# EAGLE design samd21_sensorhub_1.2.5_dec2023 (EAGLE 9.6.2)
VERSION: V1.1 Jan 2022

## Sheet 1 of 2
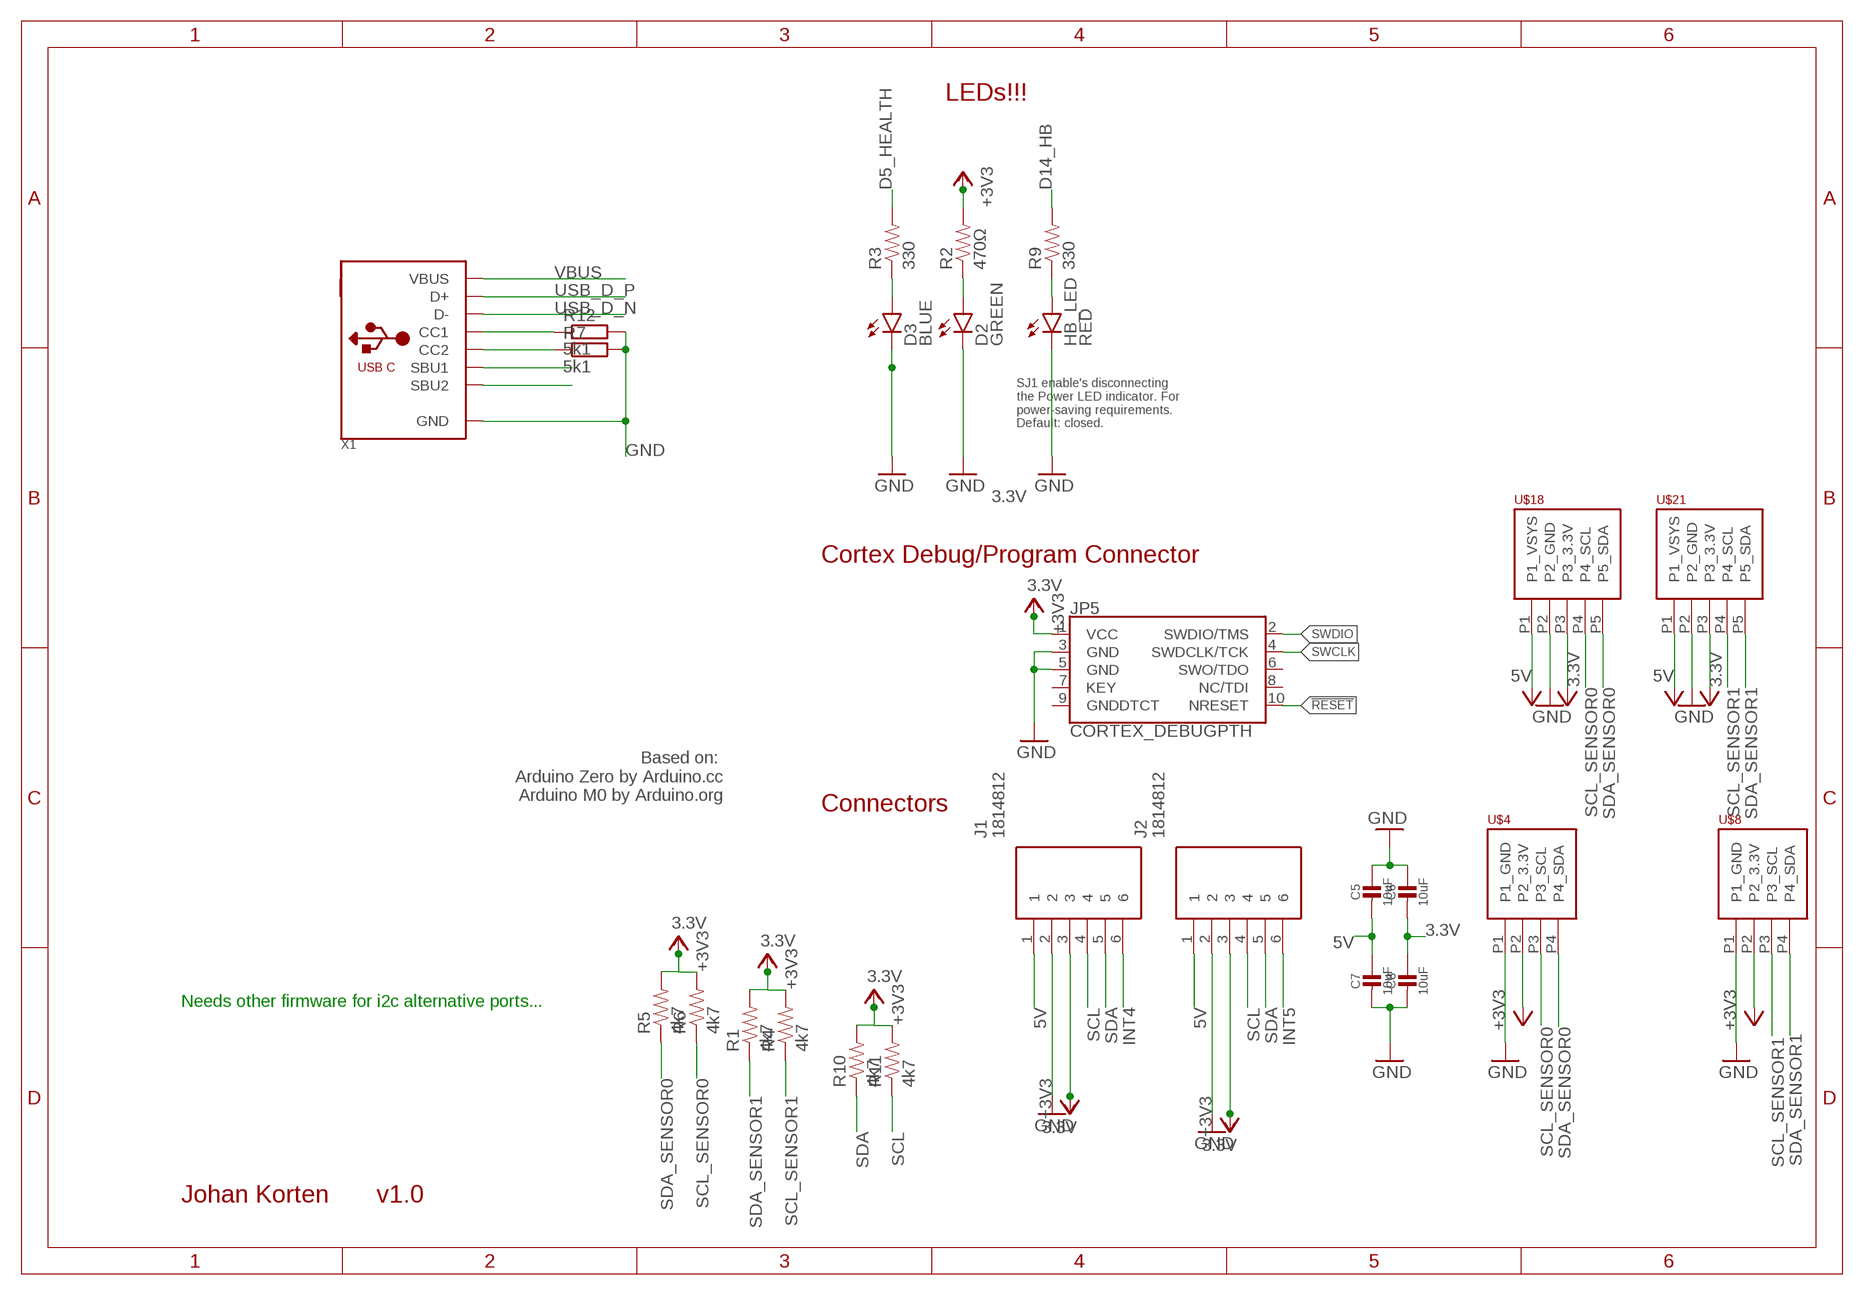
[diagram p0: schematic, sheet 1]

### Parts
C5  10uF  CAP_CERAMIC0805-NOOUTLINE  [0805-NO]
C6  10uF  CAP_CERAMIC0805-NOOUTLINE  [0805-NO]
C7  10uF  CAP_CERAMIC0805-NOOUTLINE  [0805-NO]
C8  10uF  CAP_CERAMIC0805-NOOUTLINE  [0805-NO]
D2  GREEN  LED-RED0603  [LED-0603]
D3  BLUE  LED-BLUE0603  [LED-0603]
HB_LED  RED  LED-RED0603  [LED-0603]
J1  1814812  [1814812]
J2  1814812  [1814812]
JP5  CORTEX_DEBUGPTH  [2X5-PTH-1.27MM]
R1  4k7  330OHM1/10W1%(0603)  [0603-RES]
R2  470Ω  330OHM1/10W1%(0603)  [0603-RES]
R3  330  330OHM1/10W1%(0603)  [0603-RES]
R4  4k7  330OHM1/10W1%(0603)  [0603-RES]
R5  4k7  330OHM1/10W1%(0603)  [0603-RES]
R6  4k7  330OHM1/10W1%(0603)  [0603-RES]
R7  5k1  R-EU_R0603  [R0603]
R9  330  330OHM1/10W1%(0603)  [0603-RES]
R10  4k7  330OHM1/10W1%(0603)  [0603-RES]
R11  4k7  330OHM1/10W1%(0603)  [0603-RES]
R12  5k1  R-EU_R0603  [R0603]
U$4  PHOENIX_PTSM_M4_THANGLE  [PTSM_M4_TH]
U$8  PHOENIX_PTSM_M4_THANGLE  [PTSM_M4_TH]
U$18  PHOENIX_PTSM_M5_TH_I2C++  [PTSM_M5_THRHOLE]
U$21  PHOENIX_PTSM_M5_TH_I2C++  [PTSM_M5_THRHOLE]
X1  USB_C  [USB_C_CUSB31-CFM2AX-01-X]

### Nets
3.3V [power]: C6.2 C8.1 J1.3 J2.3 JP5.1(VCC) R1.2 R2.2 R4.2 R5.2 R6.2 R10.2 R11.2 U$4.P2(P2_3.3V) U$8.P2(P2_3.3V) U$18.P3(P3_3.3V) U$21.P3(P3_3.3V) ; supply symbol labelled +3V3 ; also sheet 2
5V [power]: C5.2 C7.1 J1.1 J2.1 U$18.P1(P1_VSYS) U$21.P1(P1_VSYS) ; supply symbol labelled +5V ; also sheet 2
!RESET: JP5.10(NRESET) ; also sheet 2
D5_HEALTH: R3.2 ; also sheet 2
D5_HEALTH_LED: D3.A R3.1
D14_HB: R9.2 ; also sheet 2
D14_HB_LED: HB_LED.A R9.1
GND [ground]: C5.1 C6.1 C7.2 C8.2 D2.C D3.C HB_LED.C J1.2 J2.2 JP5.3(GND) JP5.5(GND) R7.2 R12.2 U$4.P1(P1_GND) U$8.P1(P1_GND) U$18.P2(P2_GND) U$21.P2(P2_GND) X1.A1B12(GND) X1.B1A12(GND) ; also sheet 2
INT4: J1.6 ; also sheet 2
INT5: J2.6 ; also sheet 2
N$1: R12.1 X1.A5(CC1)
N$2: R7.1 X1.B5(CC2)
N$5: D2.A R2.1
N$7: X1.A8(SBU1)
N$9: X1.B8(SBU2)
SCL: J1.4 J2.4 R11.1 ; also sheet 2
SCL_SENSOR0: R6.1 U$4.P3(P3_SCL) U$18.P4(P4_SCL) ; also sheet 2
SCL_SENSOR1: R4.1 U$8.P3(P3_SCL) U$21.P4(P4_SCL) ; also sheet 2
SDA: J1.5 J2.5 R10.1 ; also sheet 2
SDA_SENSOR0: R5.1 U$4.P4(P4_SDA) U$18.P5(P5_SDA) ; also sheet 2
SDA_SENSOR1: R1.1 U$8.P4(P4_SDA) U$21.P5(P5_SDA) ; also sheet 2
SWCLK: JP5.4(SWDCLK/TCK) ; also sheet 2
SWDIO: JP5.2(SWDIO/TMS) ; also sheet 2
USB_D_N [usb]: X1.A7(D-) X1.B7(D-) ; also sheet 2
USB_D_P [usb]: X1.A6(D+) X1.B6(D+) ; also sheet 2
VBUS [power]: X1.A4B9(VBUS) X1.B4A9(VBUS) ; also sheet 2
Unconnected: JP5.6(SWO/TDO) JP5.7(KEY) JP5.8(NC/TDI) JP5.9(GNDDTCT)

### Notes on the sheet
- LEDs!!!
- SJ1 enable's disconnecting
  the Power LED indicator. For
  power-saving requirements.
  Default: closed.
- Cortex Debug/Program Connector
- Based on: 
  Arduino Zero by Arduino.cc
  Arduino M0 by Arduino.org
- Connectors
- Needs other firmware for i2c alternative ports...
- Johan Korten | v1.0

## Sheet 2 of 2: Controller SAMD21 based on Adafruit Feather M0 Express
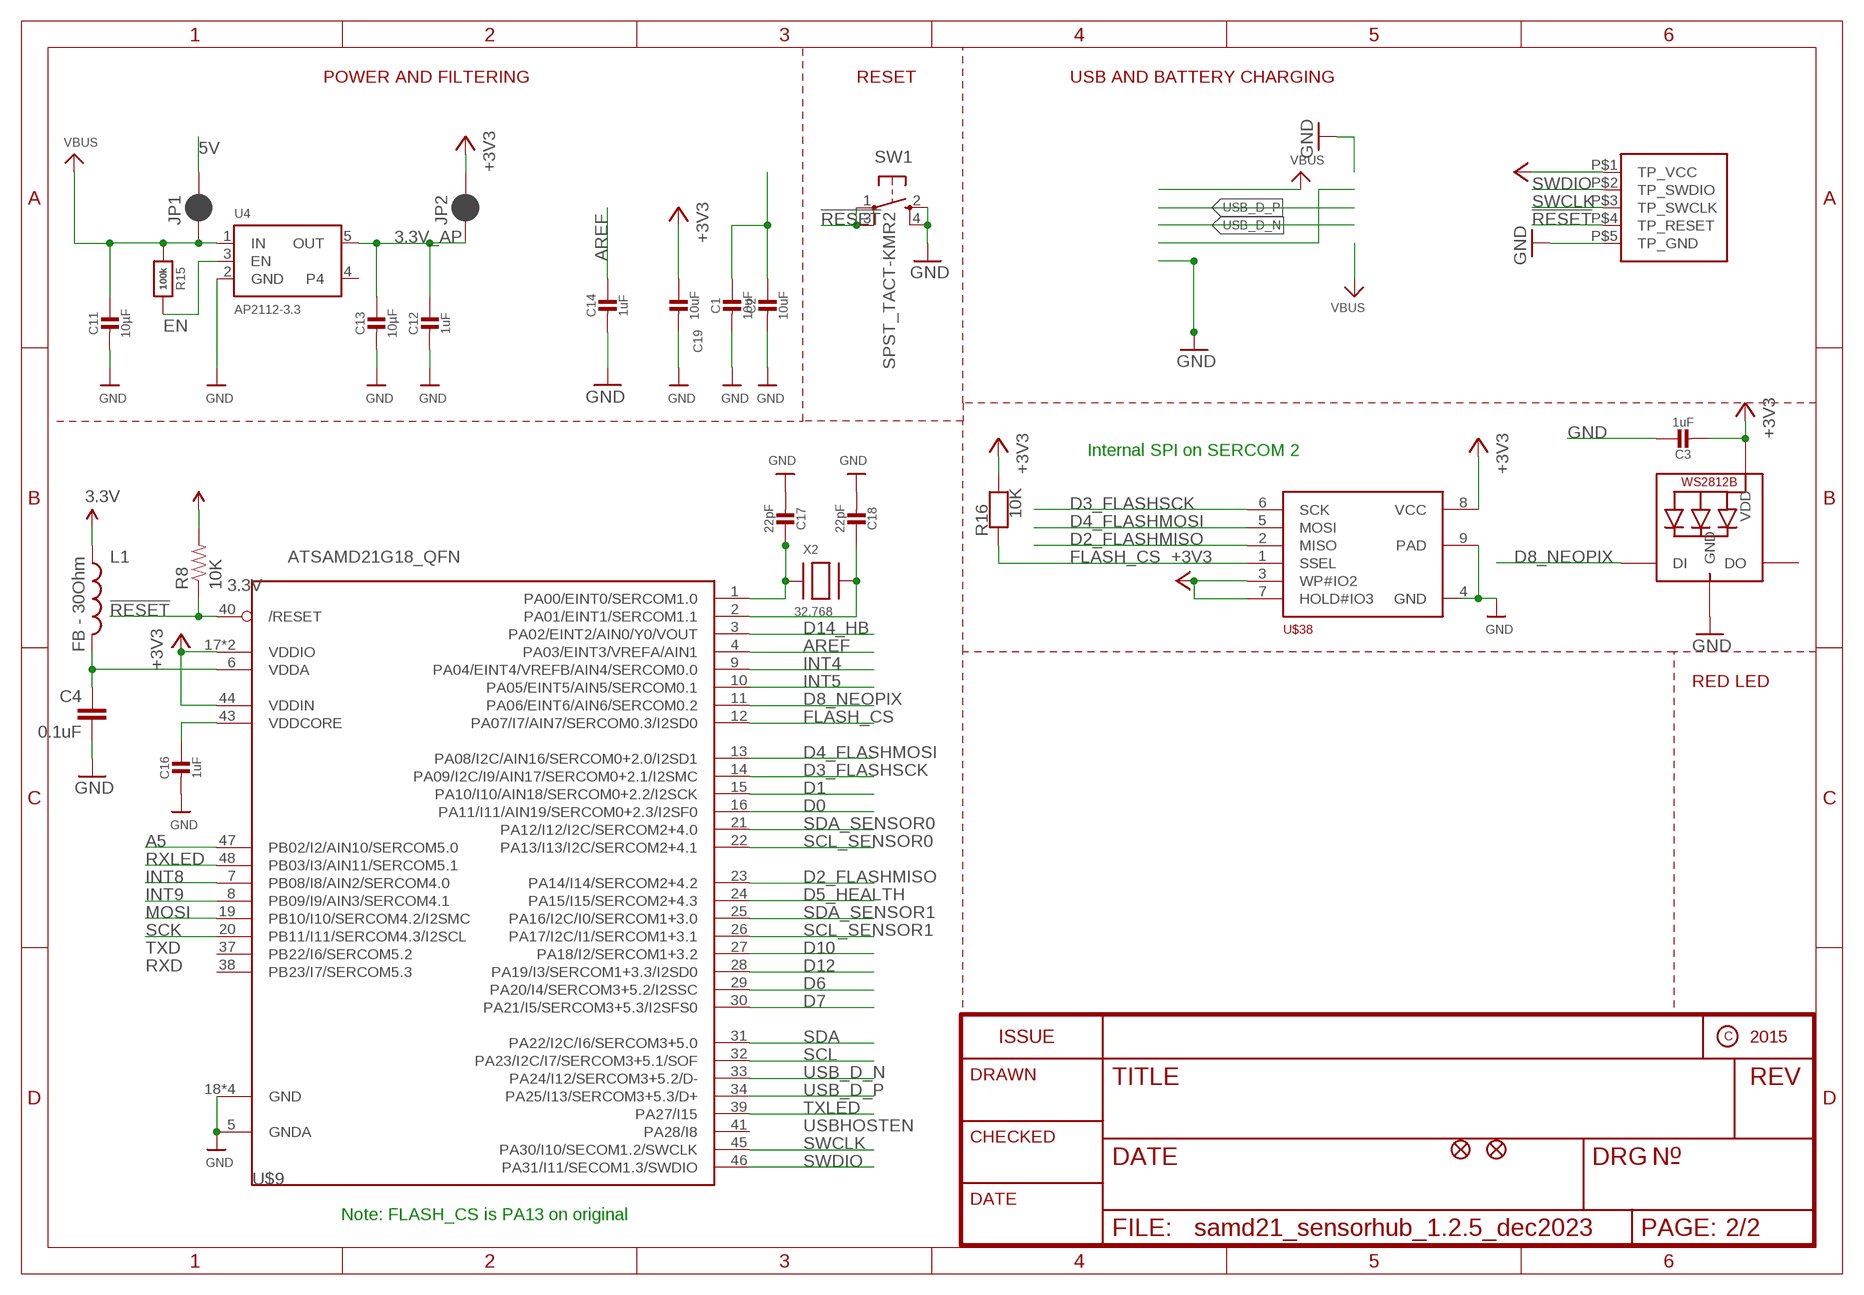
[diagram p1: schematic, sheet 2]

### Parts
C1  10uF  CAP_CERAMIC0805-NOOUTLINE  [0805-NO]
C2  10uF  CAP_CERAMIC0805-NOOUTLINE  [0805-NO]
C3  1uF  CAP_CERAMIC0603_NO  [0603-NO]
C4  0.1uF  0.1UF-16V(+-10%)(0402)  [0402-CAP]
C11  10µF  CAP_CERAMIC0805-NOOUTLINE  [0805-NO]
C12  1uF  CAP_CERAMIC0603_NO  [0603-NO]
C13  10µF  CAP_CERAMIC0805-NOOUTLINE  [0805-NO]
C14  1uF  CAP_CERAMIC0603_NO  [0603-NO]
C16  1uF  CAP_CERAMIC0603_NO  [0603-NO]
C17  22pF  CAP_CERAMIC0603_NO  [0603-NO]
C18  22pF  CAP_CERAMIC0603_NO  [0603-NO]
C19  10uF  CAP_CERAMIC0805-NOOUTLINE  [0805-NO]
JP1  JUMPER-SMT_2_NC_PASTE_SILK  [SMT-JUMPER_2_NC_PASTE_SILK]
JP2  JUMPER-SMT_2_NC_PASTE_SILK  [SMT-JUMPER_2_NC_PASTE_SILK]
L1  FB - 30Ohm  INDUCTOR0603  [0603]
LED1  WS2812B3535  [LED3535]
R8  10K  10KOHM-1/10W-1%(0603)0603  [0603-RES]
R15  100k  RESISTOR_0603_NOOUT  [0603-NO]
R16  10K  RESISTOR_0603_NOOUT  [0603-NO]
SW1  SPST_TACT-KMR2  [KMR2]
U4  AP2112-3.3  VREG_SOT23-5  [SOT23-5]
U$5  HUB_TESTPINSHUBS  [TEST_PINS]
U$9  ATSAMD21G18_QFN  ATSAMD21G_QFN  [TQFN48_7MM]
U$34  FIDUCIAL""  [FIDUCIAL_1MM]
U$35  FIDUCIAL""  [FIDUCIAL_1MM]
U$38  S25FL064LABNFI040  [SON80P400X400X60-9N]
X2  32.768  XTAL-3.2X1.5  [XTAL3215]

### Nets
3.3V [power]: C3.2 C19.1 JP2.2 L1.1 LED1.2(VDD) R8.2 R16.2 U$5.P$1(TP_VCC) U$9.17(VDDIO) U$9.36(VDDIO) U$9.44(VDDIN) U$38.3(WP#IO2) U$38.7(HOLD#IO3) U$38.8(VCC) ; supply symbol labelled +3V3 ; also sheet 1
3.3V_AP [power]: C12.1 C13.1 JP2.1 U4.5(OUT)
5V [power]: C1.1 C2.1 JP1.2 ; also sheet 1
!RESET: R8.1 SW1.1(P) SW1.3(P1) U$5.P$4(TP_RESET) U$9.40(/RESET) ; also sheet 1
A5: U$9.47(PB02/I2/AIN10/SERCOM5.0)
AREF [power]: C14.1 U$9.4(PA03/EINT3/VREFA/AIN1)
D0: U$9.16(PA11/I11/AIN19/SERCOM0+2.3/I2SF0)
D1: U$9.15(PA10/I10/AIN18/SERCOM0+2.2/I2SCK)
D2_FLASHMISO: U$9.23(PA14/I14/SERCOM2+4.2) U$38.2(MISO)
D3_FLASHSCK: U$9.14(PA09/I2C/I9/AIN17/SERCOM0+2.1/I2SMC) U$38.6(SCK)
D4_FLASHMOSI: U$9.13(PA08/I2C/AIN16/SERCOM0+2.0/I2SD1) U$38.5(MOSI)
D5_HEALTH: U$9.24(PA15/I15/SERCOM2+4.3) ; also sheet 1
D6: U$9.29(PA20/I4/SERCOM3+5.2/I2SSC)
D7: U$9.30(PA21/I5/SERCOM3+5.3/I2SFS0)
D8_NEOPIX: LED1.1(DI) U$9.11(PA06/EINT6/AIN6/SERCOM0.2)
D10: U$9.27(PA18/I2/SERCOM1+3.2)
D12: U$9.28(PA19/I3/SERCOM1+3.3/I2SD0)
D14_HB: U$9.3(PA02/EINT2/AIN0/Y0/VOUT) ; also sheet 1
EN: R15.2 U4.3(EN)
FLASH_CS: R16.1 U$9.12(PA07/I7/AIN7/SERCOM0.3/I2SD0) U$38.1(SSEL)
GND [ground]: C1.2 C2.2 C3.1 C4.2 C11.2 C12.2 C13.2 C14.2 C16.2 C17.2 C18.2 C19.2 LED1.4(GND) SW1.2(S) SW1.4(S1) U4.2(GND) U$5.P$5(TP_GND) U$9.5(GNDA) U$9.18(GND) U$9.35(GND) U$9.42(GND) U$9.THERMAL(GND) U$38.4(GND) U$38.9(PAD) ; also sheet 1
INT4: U$9.9(PA04/EINT4/VREFB/AIN4/SERCOM0.0) ; also sheet 1
INT5: U$9.10(PA05/EINT5/AIN5/SERCOM0.1) ; also sheet 1
INT8: U$9.7(PB08/I8/AIN2/SERCOM4.0)
INT9: U$9.8(PB09/I9/AIN3/SERCOM4.1)
MOSI: U$9.19(PB10/I10/SERCOM4.2/I2SMC)
N$15: C17.1 U$9.1(PA00/EINT0/SERCOM1.0) X2.P$1
N$17: C18.1 U$9.2(PA01/EINT1/SERCOM1.1) X2.P$2
RXLED: U$9.48(PB03/I3/AIN11/SERCOM5.1)
SCK: U$9.20(PB11/I11/SERCOM4.3/I2SCL)
SCL: U$9.32(PA23/I2C/I7/SERCOM3+5.1/SOF) ; also sheet 1
SCL_SENSOR0: U$9.22(PA13/I13/I2C/SERCOM2+4.1) ; also sheet 1
SCL_SENSOR1: U$9.26(PA17/I2C/I1/SERCOM1+3.1) ; also sheet 1
SDA: U$9.31(PA22/I2C/I6/SERCOM3+5.0) ; also sheet 1
SDA_SENSOR0: U$9.21(PA12/I12/I2C/SERCOM2+4.0) ; also sheet 1
SDA_SENSOR1: U$9.25(PA16/I2C/I0/SERCOM1+3.0) ; also sheet 1
SWCLK: U$5.P$3(TP_SWCLK) U$9.45(PA30/I10/SECOM1.2/SWCLK) ; also sheet 1
SWDIO: U$5.P$2(TP_SWDIO) U$9.46(PA31/I11/SECOM1.3/SWDIO) ; also sheet 1
TXLED: U$9.39(PA27/I15)
USB_D_N [usb]: U$9.33(PA24/I12/SERCOM3+5.2/D-) ; also sheet 1
USB_D_P [usb]: U$9.34(PA25/I13/SERCOM3+5.3/D+) ; also sheet 1
VBUS [power]: C11.1 JP1.1 R15.1 U4.1(IN) ; also sheet 1
VDDANA: C4.1 L1.2 U$9.6(VDDA)
VDDCORE1: C16.1 U$9.43(VDDCORE)
Unconnected: LED1.3(DO) U4.4 U$9.37(PB22/I6/SERCOM5.2) U$9.38(PB23/I7/SERCOM5.3) U$9.41(PA28/I8)

### Notes on the sheet
- POWER AND FILTERING | RESET | USB AND BATTERY CHARGING
- Internal SPI on SERCOM 2
- RED LED
- TXD
- RXD
- USBHOSTEN
- Note: FLASH_CS is PA13 on original

## Library data of the parts
C1-C3 C5-C8 C11-C14 C16-C19 = microbuilder:CAP_CERAMIC: Ceramic Capacitors For new designs, use the packages preceded by an '_' character since they are more reliable: The following footprints should be used on most boards: _0402 - Standard footprint for regular board layouts _0603 - Standard footprint for regular board layouts _0805 - Standard footprint for regular board layouts _1206 - Standard footprint for regular board layouts For extremely tight-pitch boards where space is at a premium, the following 'micro-pitch' footprints can be used (smaller pads, no silkscreen outline, etc.): _0402MP - Micro-pitch footprint for very dense/compact boards _0603MP - Micro-pitch footprint for very dense/compact boards _0805MP - Micro-pitch footprint for very dense/compact boards _1206MP - Micro-pitch footprint for very dense/compact boards
C4 = SparkFun-Capacitors:0.1UF-16V(+-10%)(0402); PROD_ID: CAP-12416
D2 = SparkFun-LED:LED-RED: Assorted Red LEDs LilyPad 1206- DIO-09912 1206- DIO-00809 0603- DIO-00819 "SMART" means more efficient and expensive; PROD_ID: DIO-00819; VALUE: RED
D3 = SparkFun-LED:LED-BLUE: Blue LEDs for production use Various blue LEDs stocked by SparkFun production 0603 - DIO-08575 Rebel - DIO-09553 1206 - DIO-09911; PROD_ID: DIO-08575
HB_LED = SparkFun-LED:LED-RED: Assorted Red LEDs LilyPad 1206- DIO-09912 1206- DIO-00809 0603- DIO-00819 "SMART" means more efficient and expensive; PROD_ID: DIO-00819
J1 J2 = 1814812:1814812: PCB header, nominal cross section: 0.5 mm?, color: black, nominal current: 6 A, rated voltage (III/2): 160 V, contact surface: Tin, type of contact: Male connector, Number of potentials: 6, Number of rows: 1, Number of positions per row: 6, number of connections: 6, product range: PTSM 0,5/..-HH-THR, pitch: 2.5 mm, mounting: THR soldering, pin layout: Linear pinning, solder pin [P]: 2 mm, Stecksystem: COMBICON COMPACT PTSM, Locking: without, type of packaging: 32 mm wide tape, Article with anti-rotation pin Source: Datasheet <http://www.phoenixcontact.com/de/produkte/1814812/pdf>; DESCRIPTION: PCB header, nominal cross section: 0.5 mm?, color: black, nominal current: 6 A, rated voltage (III/2): 160 V, contact surface: Tin, type of contact: Male connector, Number of potentials: 6, Number of rows: 1, Number of positions per row: 6, number of connections: 6, product range: PTSM 0,5/..-HH-THR, pitch: 2.5 mm, mounting: THR soldering, pin layout: Linear pinning, solder pin [P]: 2 mm, Stecksystem: COMBICON COMPACT PTSM, Locking: without, type of packaging: 32 mm wide tape, Article with anti-rotation pin; HEIGHT: 5.1mm; MANUFACTURER_NAME: Phoenix Contact; MANUFACTURER_PART_NUMBER: 1814812; MOUSER_PART_NUMBER: 651-1814812; MOUSER_PRICE-STOCK: https://www.mouser.co.uk/ProductDetail/Phoenix-Contact/1814812?qs=iCzJi%2FIZBF412xCWqGZEQw%3D%3D
JP1 JP2 = SparkFun-Jumpers:JUMPER-SMT_2_NC_PASTE: Normally closed solder jumper This jumper has an aperture in the stencil to allow solder paste to bridge the split in the wire so it's normally closed (NC). Wick off the solder to open the connection. Reapply solder to reclose the connection.
JP5 = samd21-temp:CORTEX_DEBUG: Cortex Debug Connector Datasheet <http://infocenter.arm.com/help/topic/com.arm.doc.faqs/attached/13634/cortex_debug_connectors.pdf>
L1 = SparkFun-Passives:INDUCTOR: Inductors Basic Inductor/Choke - 0603 and 1206. Footprints are not proven and vary greatly between part numbers. INDUCTOR POWER 3.3UH 4.0A SMD 0.197" L x 0.197" W x 0.177" H (5.00mm x 5.00mm x 4.50mm); PROD_ID: RES-07859
LED1 = microbuilder:WS2812B
R1 R2 R4-R6 R10 R11 = SparkFun-Resistors:330OHM1/10W1%(0603): RES-00818; PROD_ID: RES-00818; VALUE: 330
R3 R9 = SparkFun-Resistors:330OHM1/10W1%(0603): RES-00818; PROD_ID: RES-00818
R7 R12 = rcl:R-EU_: RESISTOR, European symbol; SPICEPREFIX: R
R8 = SparkFun-Resistors:10KOHM-1/10W-1%(0603): RES-00824; PROD_ID: RES-00824
R15 R16 = microbuilder:RESISTOR: Resistors For new designs, use the packages preceded by an '_' character since they are more reliable: The following footprints should be used on most boards: _0402 - Standard footprint for regular board layouts _0603 - Standard footprint for regular board layouts _0805 - Standard footprint for regular board layouts _1206 - Standard footprint for regular board layouts For extremely tight-pitch boards where space is at a premium, the following 'micro-pitch' footprints can be used (smaller pads, no silkscreen outline, etc.): _0402MP - Micro-pitch footprint for very dense/compact boards _0603MP - Micro-pitch footprint for very dense/compact boards _0805MP - Micro-pitch footprint for very dense/compact boards _1206MP - Micro-pitch footprint for very dense/compact boards
SW1 = adafruit:SPST_TACT: SMT 6mm switch, EVQQ2 series http://www.ladyada.net/library/eagle
U4 = microbuilder:VREG_SOT23-5: SOT23-5 Fixed Voltage Regulators Part Current Out V Out V In V Dropout θJA (°C/W) TJ (°C) Digikey Part No. ADP121 150mA 3.3V 3.4-5.5V 0.09V @ 150mA -- -- ADP121-AUJZ33R7CT-ND ADP121 150mA 3.0V 3.1-5.5V 0.09V @ 150mA -- -- ADP121-AUJZ30R7CT-ND ADP122 300mA 3.3V 3.4-5.5V 0.085V @ 300mA -- -- ADP122AUJZ-3.3-R7CT-ND ADP1712 300mA 3.3V 3.5-5.5V 0.17V @ 300mA -- -- ADP1712AUJZ-3.3-R7TR-ND AP7311 (Low Cost) 150mA 3.3V 3.5-6V 0.15V @ 150mA -- -- AP7311-33WG-7DICT-ND LD39015M18R 150mA 1.8V 1.9V-5.5V 0.08V @ 100mA -- -- 497-6977-1-ND LP2985A-33DBVR 150mA 3.3V 3.3-16V 0.28V @ 150mA 206 150 296-18479-1-ND MCP1824T-3302E/OT 300mA 3.3V 3.5V-6V 0.2V @ 300mA -- -- MCP1824T-3302E/OTCT-ND MIC5205-2.5YM5 TR 150mA 2.5V 2.7-16V 0.165V @ 150mA -- -- 576-1257-2-ND MIC5205-3.0YM5 TR 150mA 3.0V 3.2V-16V 0.165V @ 150mA -- -- 576-1258-2-ND MIC5205-3.3YM5 TR 150mA 3.3V 3.5V-16V 0.165V @ 150mA -- -- 576-1259-2-ND TPS780330220 150mA 3.3V+2.2V 3.6-5.5V 250mV Max -- -- 296-23332-1-ND TDA3663/N1,135 100mA 3.3V 3.5-45V 0.18V @ 50mA -- -- 568-5343-1-ND Max operating temp can be calculated using θJA, TJ (max junction temperature), and power in watts. Set the "Maximum Ambient Temperature" until it reaches TJ ("Max Junction Temperature"), which is the absolute limit for safe use of the regulator: Heat Sink Temperature Calculator <http://www.daycounter.com/Calculators/Heat-Sink-Temperature-Calculator.phtml> For example, With 12V source into a 3.3V LP2985 and a 30mA load, we are dissipating (12V-3.3V) * 0.03A = 0.261W. With a θJA of 206 °C/W, a TJ of 150°C, and 261mW we can safely use the chip without a heat sink up to 75°C (=147.1°C Junction Temperature).
U$4 U$8 = jk_customs:PHOENIX_PTSM_M4_TH
U$5 = jk_customs:HUB_TESTPINS
U$9 = microbuilder:ATSAMD21G
U$18 U$21 = jk_customs:PHOENIX_PTSM_M5_TH: Datasheet Phoenix PTSM 0,5/ 5-HH-2,5-THR R32 <https://www.phoenixcontact.com/online/portal/us?uri=pxc-oc-itemdetail:pid=1778654&library=usen&pdfmode=direct&pdflanguage=en>
U$34 U$35 = microbuilder:FIDUCIAL: Fiducial Alignment Points Various fiducial points for machine vision alignment.; BOM: EXCLUDE
U$38 = SON80P400X400X60-9N:S25FL064LABNFI040
X1 = microbuilder:USB_C: USB Type-C USB 2.0 Connector
X2 = adafruit2:XTAL: Low cost SMT crystals, no capacitors included http://www.ladyada.net/library/eagle

## Net classes
1 usb: width 0.152 mm, drill 0.254 mm, clearance 0.152 mm
2 ground: width 0.254 mm, drill 0.254 mm, clearance 0.152 mm
3 power: width 0.254 mm, drill 0.254 mm, clearance 0.152 mm

## Board
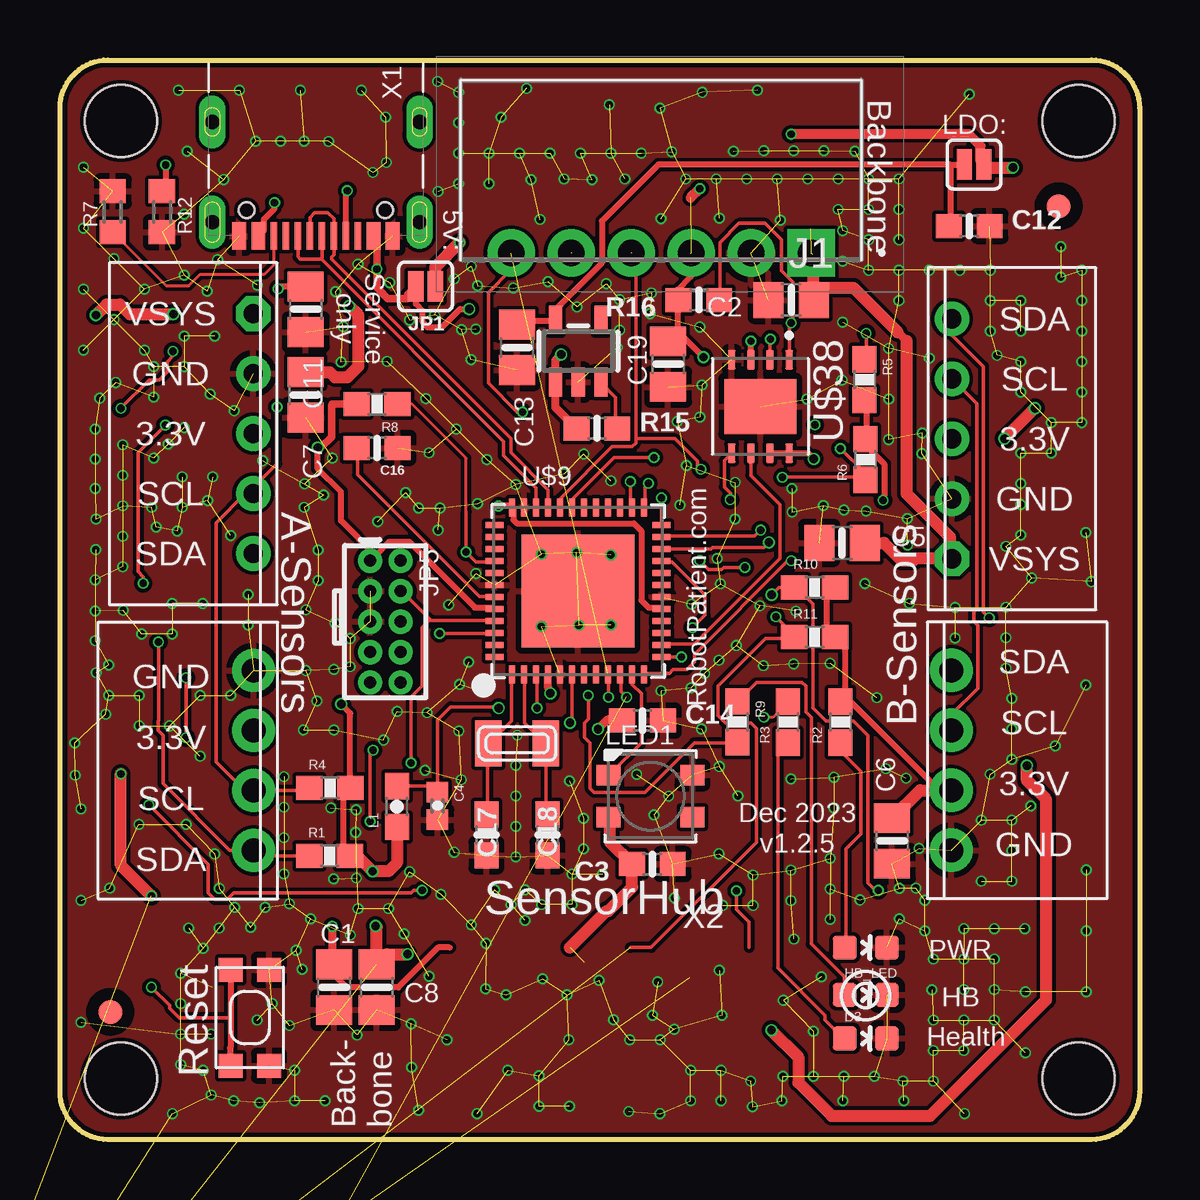
[diagram p2: board, top side]
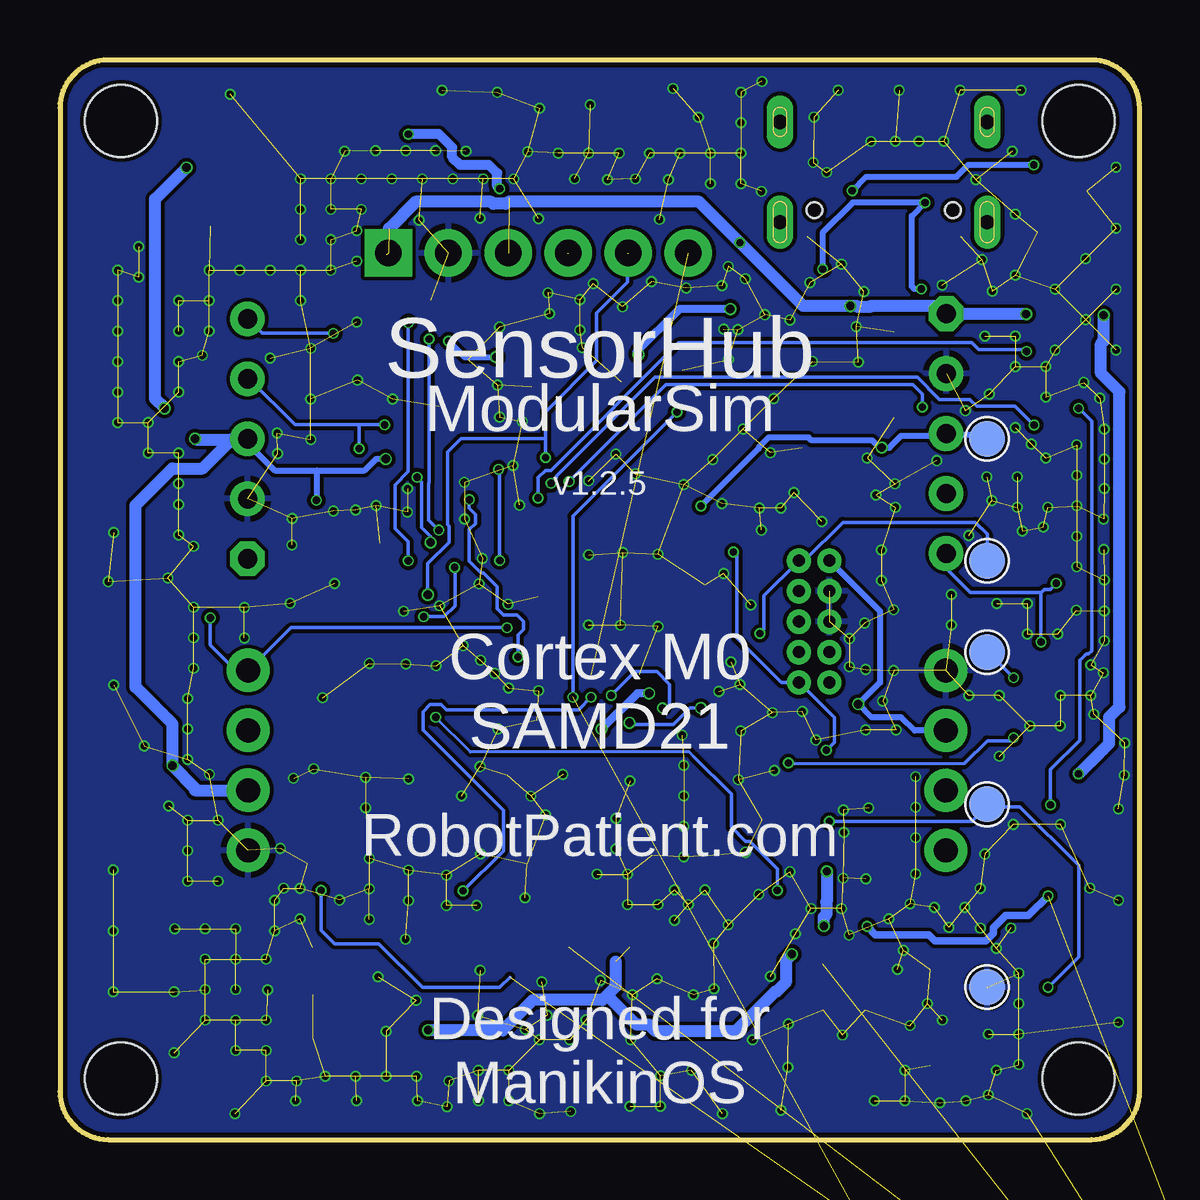
[diagram p3: board, bottom side, seen from below]

Size 45 x 45 mm. Coordinates in mm from the lower left corner, seen from the top.
Outline: 2,45 43,45 arc-90 45,43 45,2 arc-90 43,0 2,0 arc-90 0,2 0,43 arc-90 2,45
Copper layers (1*16): Top 0.035mm / dielectric 1.6mm / Bottom 0.035mm
Design rules "jlcpcb-2layers_2023": minimum track width 5mil, minimum drill 0.3mm, track to track 5mil, track to pad 5mil, pad to pad 5mil, via to via 5mil, smd to smd 5mil, copper to edge 0.2mm, drill to drill 6mil, minimum pad ring 10mil, minimum via ring 3mil, stop-mask expansion 4mil, vias tented up to drill 20mil, thermal gap 10mil
Holes 3 mm at 2.54,42.46 2.54,2.54 42.46,2.54 42.46,42.46

### Footprints (pad centres in the part's own frame; a part is rotated, then mirrored left to right if it is on the bottom)
0805-NO = smd 1.24 x 1.5: 1 -0.95,0; 2 0.95,0
0603-NO = smd 1.075 x 1: 1 -0.85,0; 2 0.85,0
0402-CAP = smd 0.85 x 0.9: 1 -0.58,0; 2 0.58,0
LED-0603 = smd 1 x 1: A 0,-0.877; C 0,0.877
1814812 = drill 1.1 pad 1.65 square: 1 0,0 | drill 1.1 pad 1.65: 2 2.5,0; 3 5,0; 4 7.5,0; 5 10,0; 6 12.5,0
SMT-JUMPER_2_NC_PASTE_SILK = smd 0.635 x 1.27: 1 -0.406,0; 2 0.406,0
2X5-PTH-1.27MM = drill 0.508 pad 1: 1 -2.54,-0.635; 2 -2.54,0.635; 3 -1.27,-0.635; 4 -1.27,0.635; 5 0,-0.635; 6 0,0.635; 7 1.27,-0.635; 8 1.27,0.635; 9 2.54,-0.635; 10 2.54,0.635
0603 = smd 1.1 x 1: 1 -0.85,0; 2 0.85,0
LED3535 = smd 1 x 0.85: 1 -1.75,0.875; 2 -1.75,-0.875; 3 1.75,-0.875; 4 1.75,0.875
0603-RES = smd 1.1 x 1: 1 -0.85,0; 2 0.85,0
R0603 = smd 1 x 1.1: 1 -0.85,0; 2 0.85,0
KMR2 = smd 1 x 1: 1 2,0.8; 2 2,-0.8; 3 -2,0.8; 4 -2,-0.8
SOT23-5 = smd 0.55 x 1.2: 1 -0.95,-1.3; 2 0,-1.3; 3 0.95,-1.3; 4 0.95,1.3; 5 -0.95,1.3
PTSM_M4_TH = drill 1: P1 3.75,1; P2 1.25,1; P3 -1.25,1; P4 -3.75,1
TEST_PINS = smd 1.5 x 1.5 bottom: P$1 6.35,29.21; P$2 6.35,24.13; P$3 6.35,20.32; P$4 6.35,13.97; P$5 6.35,6.35
TQFN48_7MM = smd 0.25 x 0.75: 1 -2.75,-3.475; 2 -2.25,-3.475; 3 -1.75,-3.475; 4 -1.25,-3.475; 5 -0.75,-3.475; 6 -0.25,-3.475; 7 0.25,-3.475; 8 0.75,-3.475; 9 1.25,-3.475; 10 1.75,-3.475; 11 2.25,-3.475; 12 2.75,-3.475; 25 2.75,3.475; 26 2.25,3.475; 27 1.75,3.475; 28 1.25,3.475; 29 0.75,3.475; 30 0.25,3.475; 31 -0.25,3.475; 32 -0.75,3.475; 33 -1.25,3.475; 34 -1.75,3.475; 35 -2.25,3.475; 36 -2.75,3.475 | smd 0.75 x 0.25: 13 3.475,-2.75; 14 3.475,-2.25; 15 3.475,-1.75; 16 3.475,-1.25; 17 3.475,-0.75; 18 3.475,-0.25; 19 3.475,0.25; 20 3.475,0.75; 21 3.475,1.25; 22 3.475,1.75; 23 3.475,2.25; 24 3.475,2.75; 37 -3.475,2.75; 38 -3.475,2.25; 39 -3.475,1.75; 40 -3.475,1.25; 41 -3.475,0.75; 42 -3.475,0.25; 43 -3.475,-0.25; 44 -3.475,-0.75; 45 -3.475,-1.25; 46 -3.475,-1.75; 47 -3.475,-2.25; 48 -3.475,-2.75 | smd 4.7 x 4.7: THERMAL 0,0
PTSM_M5_THRHOLE = drill 0.8 octagon: P1 5,1 | drill 0.8: P2 2.5,1; P3 0,1; P4 -2.5,1; P5 -5,1
FIDUCIAL_1MM = smd 1 x 1: 1 0,0
SON80P400X400X60-9N = smd 0.81 x 0.32: 1 -1.95,1.2; 2 -1.95,0.4; 3 -1.95,-0.4; 4 -1.95,-1.2; 5 1.95,-1.2; 6 1.95,-0.4; 7 1.95,0.4; 8 1.95,1.2 | smd 2.3 x 3: 9 0,0
USB_C_CUSB31-CFM2AX-01-X = smd 0.575 x 1.15: A1B12 -3.2,7.355; A4B9 -2.4,7.355; B1A12 3.2,7.355; B4A9 2.4,7.355 | smd 0.275 x 1.15: A5 -1.25,7.355; A6 -0.25,7.355; A7 0.25,7.355; A8 1.25,7.355; B5 1.75,7.355; B6 0.75,7.355; B7 -0.75,7.355; B8 -1.75,7.355 | drill 0.6 pad 1 long: M1 -4.32,6.78; M2 4.32,6.78; M3 -4.32,2.6; M4 4.32,2.6 | hole 0.65: 2.89,6.28; -2.89,6.28
XTAL3215 = smd 1.1 x 1.9: P$1 1.2,0; P$2 -1.2,0

### Placement (x,y rotation side)
C1  11.43,6.35 270 top
C2  30.48,35 180 top
C3  24.69,11.48 180 top
C4  15.74,13.91 270 top
C5  32.6,24.87 0 top
C6  34.68,12.45 90 top
C7  10.24,31.04 270 top
C8  13.21,6.35 270 top
C11  10.25,34.61 270 top
C12  37.9,38.07 0 top
C13  19.05,33.02 270 top
C14  24.28,17.46 0 top
C16  13.22,28.83 0 top
C17  17.78,12.7 270 top
C18  20.32,12.7 270 top
C19  25.35,32.32 270 top
D2  33.59,8 270 top
D3  33.59,4.21 270 top
HB_LED  33.59,6.03 270 top
J1  31.31,36.96 180 top
J2  -2.54,-6.35 0 top  (outside the outline)
JP1  15.24,35.56 0 top
JP2  38.1,40.64 0 top
JP5  13.56,21.59 270 top
L1  14.05,13.88 90 top
LED1  24.61,14.31 0 top
R1  11.24,11.82 0 top
R2  32.54,17.4 90 top
R3  30.35,17.4 90 top
R4  11.25,14.66 0 top
R5  33.54,31.67 270 top
R6  33.58,28.35 90 top
R7  2.2,38.67 90 top
R8  13.22,30.66 180 top
R9  28.23,17.41 270 top
R10  31.46,23.01 0 top
R11  31.46,20.94 0 top
R12  4.25,38.67 270 top
R15  22.38,29.64 0 top
R16  26.63,35 180 top
SW1  7.91,5.08 90 top
U4  21.6,32.87 0 top
U$4  36.15,15.81 270 top
U$5  0,0 0 top
U$8  9.07,15.8 90 top
U$9  21.59,22.86 0 top
U$18  36.18,29.21 270 top
U$21  9.06,29.43 90 top
U$34  41.63,38.9 0 top
U$35  2.1,5.32 0 top
U$38  29.2,30.56 270 top
X1  10.67,45.02 180 top
X2  19.05,16.51 180 top

### Tracks (layer width: path | path; a pad name or v marks a point on that pad's centre or on a via)
3.3V  (via drill 0.3, 0.35)  (4 unrouted)
  Top 0.254: R5.2 33.6,30.79 33.6,29.26 R6.2 33.58,28.94 34.36,28.16 34.36,26.83 34.31,26.79 v34.31,26.65 | R10.2 31.94,22.64 31.94,21.31 R11.2 32.38,20.88 32.72,20.55 32.72,18.43 R2.2 32.61,18.21 32.99,18.21 36.58,14.63 37.11,14.63 U$4.P2 | v26.82,32.61 25.83,33.6 C19.1 25.38,33.3 25.76,33.68 25.76,35.28 R16.2 25.76,35.43 26.29,35.97 26.29,36.96 | 22.94,13.41 LED1.2 | 23.85,11.35 C3.2 | U$9.17 24.99,22.17 24.54,22.17 24.23,22.48 24.23,25.38 23.93,25.68 19.05,25.68 18.9,25.83 18.9,26.29 U$9.36 18.82,26.44 18.31,26.44 v18.27,26.4 | 13.15,24.35 12.95,24.16 JP5.1 | 13.15,24.35 13.72,24.92 14.55,24.92 17.3,22.17 18.06,22.17 U$9.44 | v10.74,28.84 10.74,27.96 11.71,27 11.71,25.79 13.15,24.35 | 22.78,9.53 22.86,9.53 | U$38.7 U$38.8 31.18,28.61 v31.42,28.37 | U$38.3 v28.8,33.28 v28.8,33.29 | R1.2 11.81,12.1 11.81,14.36 R4.2 12.1,17.77 v11.72,18.15
  Top 0.305: v10.74,28.84 10.87,28.84 11.32,29.29 11.32,30.61 11.34,30.63 11.34,30.66 R8.2
  Top 0.406: JP2.2 38.37,40.78 38.37,41.42 37.88,41.91 v30.48,41.91 | 26.29,39.25 v26.67,39.63
  Top 0.508: C6.2 35.85,14.56 U$4.P2 | v40.64,30.48 v39.37,29.21 | JP2.2 38.63,40.51 v39.73,40.51 | v29.65,4.56 30.77,3.44 30.77,2.38 32.17,0.98 36.27,0.98 41.11,5.81 41.11,14.17 40.31,14.97 v40.31,15.59 | v13.16,8.9 13.21,8.85 C8.1 13.63,7.72 v14.49,7.72 | L1.1 14.05,11.54 13.69,11.18 v13.03,11.18 | v13.03,11.18 12.38,11.82 R1.2 12.39,11.82 v13.03,11.18 | 22.78,9.53 21.26,8 | 22.86,9.53 23.85,10.52 23.85,11.35 | C3.2 22.94,12.38 22.94,13.41
  Bottom 0.254: 34.29,27.89 36.04,27.89 37.11,28.96 37.11,29.18 U$18.P3 | 34.29,27.89 32.3,27.89 31.8,28.38 31.43,28.38 v31.42,28.37 | 39.37,14.56 U$4.P2 37.03,14.55 | U$5.P$1 6.38,29.25 6.51,29.38 8.05,29.38 U$21.P3 8.14,29.34 9.93,29.34 10.43,28.84 v10.74,28.84 10.84,28.84 11.14,29.14 13.68,29.14 13.79,29.26 15.46,29.26 15.88,28.84 15.88,28.79 v18.27,26.4 | JP5.1 10.82,22.02 10.82,19.05 v11.72,18.15 11.17,17.6 9.93,17.6 9.38,17.05 U$8.P2 | v28.8,33.29 28.13,32.61 v26.82,32.61 | v34.31,26.65 34.29,26.67 34.29,27.89
  Bottom 0.406: v26.67,39.63 26.77,39.74 26.77,40.28 27.11,40.62 27.82,40.62 27.83,40.62 28.31,40.62 28.65,40.96 28.65,41.36 29.2,41.91 v30.48,41.91
  Bottom 0.508: 39.37,14.56 39.37,14.55 | 39.37,14.55 37.03,14.55 | 39.37,14.55 39.37,14.64 v40.31,15.59 40.31,17.32 41.85,18.86 41.85,26.45 40.32,27.98 39.04,27.98 37.81,29.21 U$18.P3 | v39.37,29.21 39.34,29.18 37.11,29.18 | v40.64,30.48 41.03,30.87 41.03,39.2 v39.73,40.51 | 21.83,7.42 21.83,6.37 22.19,6.01 | 22.19,6.01 22.39,5.81 25.28,5.81 26.55,4.55 v29.64,4.55 v29.65,4.56 | v13.16,8.9 13.16,9.27 13.05,9.37 13.05,9.89 13.03,9.91 v13.03,11.18 | v14.49,7.72 14.75,7.46 14.75,6.54 15.12,6.17 15.19,6.17 16.85,4.51 20.18,4.51 20.45,4.79 20.96,4.79 22.19,6.01
3.3V_AP
  Top 0.254: C13.1 19.05,33.98 19.2,34.14 20.65,34.14 U4.5 20.65,34.29 20.65,34.59 22.59,36.54 22.59,38.29 24.94,40.64 37.11,40.64 | 37.11,40.64 37.11,38.1 C12.1 | 37.11,40.64 JP2.1
5V  (via drill 0.3, 0.35)  (3 unrouted)
  Top 0.254: 16.25,8 15.76,8 14.1,6.34 11.96,6.34 11.43,6.87 C1.1
  Top 0.33: 35.29,33.29 34.92,33.66 | v11.35,8.89 11.35,7.39 C1.1
  Top 0.508: C7.1 11.25,31.99 11.46,31.78 11.98,31.78 12.44,32.24 12.44,34.36 v12.05,34.75 | JP1.2 15.65,36.37 v16.66,37.39 | 31.39,36.9 31.39,35.04 C2.1 31.94,35.51 33.07,35.51 34.92,33.66 | 37.11,24.23 37.11,25.09 35.29,26.91 35.29,33.29 | U$18.P1 37.16,24.23 37.11,24.23 | C5.2 34.35,24.87 35.07,24.14 35.59,24.14 35.68,24.23 37.11,24.23 | v3.81,10.16 2.54,11.43 v2.54,15.24 | v1.5,34.37 1.94,34.81 2.51,34.81 2.91,34.4 v4.72,34.4
  Bottom 0.305: 1.18,17.69 1.27,17.6 | v3.81,10.16 4.62,9.35 5.58,9.35 6.1,8.83 6.1,8.59 6.41,8.28 8.54,8.28 8.79,8.54 11,8.54 v11.35,8.89
  Bottom 0.33: 30.18,39.09 30.19,39.08
  Bottom 0.508: 30.18,39.09 27.02,39.09 26.93,39 26.41,39 26.32,39.09 18.36,39.09 v16.66,37.39 14.02,34.75 v12.05,34.75 11.79,34.75 11.76,34.71 11.23,34.71 11.2,34.75 8.38,34.75 U$21.P1 8.03,34.4 v4.72,34.4 | 30.19,39.08 31.29,37.98 | v2.54,15.24 1.27,16.51 1.27,17.6 | 1.18,17.69 0.84,18.03 0.84,31.17 1.61,31.94 1.61,33.17 1.5,33.28 v1.5,34.37
!RESET  (via drill 0.3)
  Top 0.127: 16.93,26.16 16.93,28.4 14.67,30.66 R8.1
  Top 0.152: U$9.40 18.06,24.08 17.34,24.08 v16.93,24.49 16.93,26.16 | v13.05,16.23 12.93,16.1 v12.93,13.26 | v3.81,6.35 4.57,5.59 4.57,5.48 4.97,5.08 7.11,5.08
  Top 0.254: SW1.1 7.11,5.08 7.11,3.84 7.09,3.81 7.11,3.78 SW1.3
  Bottom 0.152: v16.93,24.49 16.79,24.35 16.79,20.9 14.94,19.05 JP5.10 14.17,19.05 12.72,17.6 12.72,16.56 v13.05,16.23 | 6.38,13.88 6.99,13.26 v12.93,13.26 | 6.38,13.88 U$5.P$4 | v3.81,6.35 2.54,7.62 2.54,11.43 4.99,13.88 6.38,13.88
AREF  (via drill 0.35)
  Top 0.33: v22.43,17.11 22.82,17.5 23.41,17.5 C14.1 | U$9.4 20.34,19.36 20.34,18.82 v20.44,18.6
  Bottom 0.33: v20.44,18.6 20.93,18.6 v22.43,17.11
D2_FLASHMISO  (via drill 0.3)
  Top 0.152: U$9.23 25.07,25.15 28.96,25.15 v29.21,25.4 | U$38.2 29.6,33.34 v29.62,33.36
  Bottom 0.152: v29.62,33.36 29.62,27.37 29.64,27.34 29.64,25.83 v29.21,25.4
D3_FLASHSCK
  Top 0.152: U$9.14 25.07,20.65 26.44,20.65 30.01,24.22 30.01,26.47 28.8,27.68 U$38.6
D4_FLASHMOSI  (via drill 0.3)
  Top 0.152: v25.91,20.12 U$9.13 | v27.94,26.67 27.94,26.95 27.69,27.21 27.69,28.3 U$38.5
  Bottom 0.152: v25.91,20.12 25.91,21.03 25.68,21.26 25.68,21.59 25.95,21.86 26.52,21.86 26.78,22.13 26.78,23.06 27.34,23.62 27.44,23.62 27.94,24.12 27.94,25.42 27.68,25.68 27.68,26.06 27.94,26.32 v27.94,26.67
D5_HEALTH  (via drill 0.3)
  Top 0.127: v29.34,17.6 29.72,17.6 30.33,18.21
  Top 0.152: v25.07,26.75 25.07,25.68 U$9.24 | 30.33,18.21 R3.2 | v4.71,32.85 4.71,32.65 4.47,32.41 4.47,31.99 4.14,31.66 3.72,31.66 v2.54,30.48 | v3.71,13.95 6.19,11.47 6.19,10.28 6.45,10.01 6.97,10.01 7.24,10.29 14.64,10.29 14.74,10.39 v15.1,10.39
  Bottom 0.127: 18.59,15.97 18.77,16.15 27.89,16.15 v29.34,17.6
  Bottom 0.152: v25.07,26.75 25.07,27.58 24.77,27.89 24.54,27.89 19.21,33.21 6.98,33.21 6.71,32.93 4.79,32.93 v4.71,32.85 | v2.54,30.48 2,29.94 2,20.38 2.13,20.24 2.22,20.24 2.49,19.98 2.49,16.64 3.71,15.42 v3.71,13.95 | v15.1,10.39 15.1,11.29 16.25,12.43 16.42,12.43 17.02,13.03 17.02,14.4 18.59,15.97
D5_HEALTH_LED
  Top 0.152: D3.A 32.69,4.27 32.69,4.34 32.54,4.34 31.89,4.99 31.89,5.18 29.92,7.15 29.92,16.12 R3.1
D8_NEOPIX
  Top 0.152: U$9.11 23.85,19.36 23.85,18.97 24.23,18.59 24.23,16.54 22.94,15.24 LED1.1
D14_HB  (via drill 0.3)
  Top 0.152: R9.2 28.19,16.54 26.44,16.54 24.38,14.48 22.25,14.48 22.1,14.63 22.1,16.54 21.87,16.76 21.87,17.37 22.02,17.53 v22.02,18.52 | v19.89,17.98 19.89,19.36 U$9.3
  Bottom 0.152: v19.89,17.98 19.81,17.91 19.58,18.14 19.58,18.97 20.12,19.51 21.03,19.51 v22.02,18.52
D14_HB_LED
  Top 0.152: HB_LED.A 32.69,6.1 32.69,6.78 31.32,8.15 31.32,17.6 31.09,17.83 31.09,18.9 30.94,19.05 29.03,19.05 28.27,18.29 R9.1
EN
  Top 0.152: R15.2 23.16,29.64 23.16,30.94 22.55,31.55 U4.3
FLASH_CS  (via drill 0.3)
  Top 0.152: U$9.12 24.38,19.43 25.4,19.43 25.55,19.58 26.13,19.58 26.44,19.9 26.44,20.22 30.35,24.13 v30.48,24.13 | R16.1 27.51,35.36 27.51,37.39 28.31,38.19 29.39,38.19 30.07,37.5 30.07,36.22 30.56,35.74 30.56,34.14 30.4,33.98 30.4,33.96 | U$38.1 30.4,33.96 | 30.4,33.96 v30.48,34.05
  Bottom 0.152: v30.48,34.05 30.48,27.85 31.04,27.29 31.04,25.48 30.48,24.92 v30.48,24.13
GND  (via drill 0.3)  (489 unrouted)
  other vias: 10.99,26.86 13.25,25.76 14.4,26.97 15.38,28.63 20.08,24.4 22.96,24.37 21.54,24.47 20.07,21.39 22.97,21.45 26.11,28.09 28.14,27.39 30.51,27.14 25.84,26.44 21.55,34.71 30.04,38.33 27.36,40.04 22.9,43.13 22.17,40.01 19.63,40.01 18.9,35.5 5.3,41.2 8.23,35.61 13.64,32.44 11.35,28.41 11.42,17.07 14.06,17.84 15.3,17.79 9.56,9.83 12.36,10.9 14.57,11.16 17.75,8.18 14.34,8.57 14.63,4.83 17.13,32.51 15.62,34.38 17.14,36.4 40.06,25.2 29.32,19.75 27.47,19.98 26.3,18.82 28.26,14.33 24.77,13.53 27.47,11.91 32.26,15.1 30.47,15.04 30.47,11.23 32.11,11.72 34.99,10.46 30.15,5.8 25.6,4.6 19.96,2.65 17.74,6.29 8.22,4.98 8.32,1.54 6.63,8.81 36.35,6.24 35.14,2.44 36.06,8.7 39.67,15.85 39.43,22.19 27.39,24.22 32.68,26.24 32.63,34.07 31.14,30.86 36.25,32.58 35.95,29.45 14.57,34.16 7.85,22.72 5.84,18.52 16.73,15 19.06,16.85 24.04,15.21 25.37,14.31 21.23,14.95 25.06,18.71 26.73,17.12 30.52,26.16 30.58,19.82 27.48,15.54 28.89,11.02 27.48,7.05 24.92,6.58 24.7,5.18 27.6,5.18 31.41,4.51 31.74,6.78 30.59,8.36 21.01,27.75 19,27.3 17.79,28.35 22.96,27.46 21.83,28.57 17.41,26.5 7.11,25.17 14.66,3.01 15.85,26.33 14.95,26.33 15.76,25.4 21.63,21.44 26.33,22.31 27.53,23.16 28.19,20.59 26.87,19.43 35.33,24.78 33.6,26.2 35.41,22.35 29.17,22.25 35.27,15.06 35.67,10.48 33.35,9.98 28.87,1.37 30.14,2.64 31.41,2.64 32.68,2.64 33.95,2.64 23.71,1.17 28.79,2.44 25.62,10.07 23.08,4.99 22.47,6.63 21.13,6.03 21.35,9.79 22.62,11.06 21.82,12.12 19,15.6 19,14.33 19,13.06 19,11.79 21.82,13.39 15.88,10.22 17.14,8.95 13.69,9.63 12.42,9.63 9.84,7.89 12.1,8.52 10.45,9.19 11.4,10.86 6.64,10.46 9.56,4.75 12.38,4.36 14.95,1.22 8.84,5.66 10.1,7.1 5.03,4.39 5.03,5.66 6.3,4.39 5.03,6.93 5.36,8.81 5.97,7.96 7.95,8.84 7.28,9.68 8.55,9.68 4.57,17.25 5.84,15.98 3.3,18.52 3.3,17.25 10.15,17.07 11.42,19.6 11.46,21.53 10.76,23.3 10.76,24.57 10.17,26.35 6.36,27.62 5.09,26.35 6.26,31.08 5.18,29.68 3.91,28.41 1.47,27.14 1.47,28.36 3.91,30.95 5.18,32.22 5.18,33.49 3.91,32.22 1.47,29.62 5.18,36.03 5.18,38.57 13.58,42.62 16.61,43.65 16.61,42.38 16.61,41.11 16.61,39.84 15.76,39.52 17.88,41.11 19.15,41.11 20.42,41.11 17.88,39.84 21.69,41.11 22.96,41.11 24.23,41.11 25.5,41.17 26.77,43.65 28.07,41.2 26.09,40.04 23.55,40.04 21.01,40.04 28.63,40.04 29.34,41.22 30.58,41.22 31.84,41.22 33.13,41.2 29.9,40.04 31.17,40.04 32.44,40.04 33.71,40.04 33.71,38.77 32.44,38.77 33.71,37.5 33.71,36.23 34.98,38.77 34.98,37.5 34.98,36.23 34.98,34.96 36.25,36.23 37.52,36.23 38.79,36.23 38.79,34.96 34.98,40.04 41.72,37.22 40.06,34.96 40.06,32.42 40.06,33.69 38.79,33.69 39.07,32.69 40.06,31.15 41.33,29.88 40.06,28.61 40.06,27.34 35.93,28.59 34.56,30.86 35.32,25.88 37.31,22.17 37.31,20.9 39.43,20.92 39.43,19.65 40.06,26.47 40.5,23.41 39.43,24.73 39.67,17.12 39.67,18.39 40.47,13.91 39.67,13.31 38.4,13.31 38.4,10.77 39.67,12.04 39.67,10.77 34.99,9.19 36.06,9.97 35.81,12.14 32.11,10.45 32.11,9.18 30.47,9.96 28.89,9.75 27.62,9.75 1.5,25.87 1.49,24.59 1.47,23.33 1.47,22.03 2.64,22.06 1.47,20.79 5.94,22.34 4.67,22.34 3.82,26.35 5.09,27.62 6.16,26.63 1.51,19.46 1.91,17.73 2.03,19.79 2.03,18.52 6.45,11.9 11.29,13.82 16.43,11.98 18.11,10.4 19.38,10.4 19.38,9.13 20.12,6.69 20.08,9.79 18.81,9.79 21.35,11.06 17.54,18.68 16.21,22.29 12.09,20.88 12.09,19.71 8.45,28.3 10.2,27.33 2.32,31.56 6.13,35.37 8.15,41.62 6.57,36.68 0.98,40.53 0.98,37.99 2.25,36.72 3.52,35.45 2.25,34.18 0.98,35.45 0.98,32.91 3.52,32.91 1.65,30.9 6.3,1.85 5.03,3.12 5.97,2.88 7.24,1.61 9.78,1.61 11.05,1.61 9.78,2.88 16.13,4.15 18.67,2.88 21.21,4.15 23.75,4.15 25.02,4.15 26.29,1.61 26.29,2.88 27.56,2.88 27.56,1.61 30.1,1.61 32.64,1.61 35.18,1.61 36.41,2.44 36.41,3.71 37.68,3.71 38.95,4.98 37.68,4.98 36.41,4.98 37.68,6.25 36.41,7.52 37.68,8.79 37.68,7.52 38.95,7.52 38.95,6.25 38.95,8.79 38.77,15.23 32.6,31.66 32.63,36.61 32.63,37.88 20.35,35.76 22.77,35.67 23.23,33.01 26.76,31.45 24.65,35.29 23.33,35.01 23.33,33.74 17.34,33.78 16.74,33.76 17.41,35.6 16.43,35.88 13.6,40.73 13.74,35.73 4.89,25.36 4.51,28.99 7.85,21.45 16.62,17.03 28.13,25.87 16.52,29.62 15.25,30.89 25.73,29.92 26.67,30.11 31.83,26.43 26.67,33.87 24.6,34.43 20.02,38.35 25.06,38.38 27.5,38.4 42.6,32.42 42.6,33.69 42.6,31.15 42.6,29.88 42.6,34.96 41.72,35.95 42.6,36.23 41.33,28.61 37.91,43.57 42.99,23.25 42.79,11.24 42.79,6.16 25.01,1.08 17.39,1.08 0.88,9.97 0.88,13.78 0.88,4.89 4.69,1.08 25.01,42.99 19.44,43.81 32.11,19.85 30.68,22.02 33.55,23.18 32.26,13.83 34.43,15.46 34.05,18.41 18.39,42.61 4.94,43.74 15.74,44.11 4.01,25.53 3.4,21.07 4.67,21.07 7.11,18.52 6.45,33.49 2.62,28.96 2.62,27.69 2.62,26.42 2.62,25.15 2.62,23.88 13.49,16.65 10.25,22.09 10.25,19.55 10.71,18.28 9.19,41.62 11.2,41.61 10.17,41.62 15.38,6.81 12.42,36.49 6.82,40.02 13.04,40.31 11.49,35.34 11.81,33.88 12.34,13.74 12.32,12.8 7.26,30.38 11.72,32.41 17.34,23.6 17.03,19.9 15.21,15.38 16.66,18.97 9.33,13.86 9.33,15.13 9.33,12.59 9.33,11.07 37.71,1.08 40.25,3.62 40.25,6.16 42.79,8.7 40.22,8.79 41.49,16.41 42.76,18.95 42.76,25.3 34.54,29.17 34.54,32.98 0.64,15.19 0.61,16.54 3.29,13.13 5.26,13.13 2.07,10.48 18.59,6.03 19.96,1.38 21.23,1.38 7.48,43.74 10.02,43.74 12.56,43.74 29.07,43.74
  pour Top: 54.61,49.53 54.61,-3.81 -5.08,-3.81 -5.08,49.53
  pour Bottom: 55.88,49.53 55.88,-2.54 -6.35,-2.54 -6.35,49.53
INT4  (via drill 0.3)  (1 unrouted)
  Top 0.152: v22.86,18.44 22.86,19.36 U$9.9 | 28.73,8 28.73,9.07 28.19,9.6 v28.19,10.36
  Bottom 0.152: v22.86,18.44 23.39,17.91 28.88,17.91 29.11,18.14 29.57,18.14 29.87,17.83 29.87,17.07 26.52,13.72 26.52,12.04 v28.19,10.36
INT5  (via drill 0.3)  (1 unrouted)
  Top 0.152: v23.62,18.44 23.39,18.67 23.39,19.36 U$9.10 | v19.28,30.33 19.05,30.33 17.86,31.52 17.86,35.31 18.75,36.2 18.75,36.96
  Bottom 0.152: v23.62,18.44 23.62,25.98 v19.28,30.33
N$1  (via drill 0.3)
  Top 0.254: X1.A5 11.92,39.5 v11.98,39.56 | v4.41,40.63 4.41,39.67 R12.1
  Bottom 0.254: v11.98,39.56 11.4,40.13 7.63,40.13 7.14,40.63 v4.41,40.63
N$2
  Top 0.127: R7.1 4.43,35.59 5.37,35.59 5.84,36.07 8.52,36.07 8.92,36.46 X1.B5
N$5
  Top 0.152: D2.A 32.77,8 32.77,12.12 33.39,12.74 33.39,15.34 32.54,16.19 R2.1
N$15
  Top 0.152: U$9.1 18.82,19.36 18.82,17.45 17.91,16.54 X2.P$1 17.83,16.46 17.83,13.56 C17.1
N$17
  Top 0.152: U$9.2 19.36,19.36 19.36,17.37 20.19,16.54 X2.P$2 20.27,16.46 20.27,13.56 C18.1
SCL  (via drill 0.3)  (2 unrouted)
  Top 0.152: U$9.32 20.88,26.36 20.88,26.75 23.01,28.88 23.85,28.88 24,29.03 24,29.21 | 23.77,8 24.64,8 29.03,12.39 29.03,17.14 28.8,17.37 27.74,17.37 27.43,17.68 27.43,18.9 29.41,20.88 30.56,20.88 R11.1 30.61,21.02 v29.84,21.79 | 24,29.21 24,36.8 23.85,36.96 | v28.55,23.85 27.67,23.85 27.58,23.76 27.04,23.76 v26.67,24.13 | v26.72,27.94 26.57,28.09 26.57,28.28 25.64,29.21 24,29.21
  Bottom 0.152: v29.84,21.79 v29.84,21.8 28.98,21.8 28.54,22.24 28.54,23.84 v28.55,23.85 | v26.72,27.94 26.67,27.89 v26.67,24.13
SCL_SENSOR0  (via drill 0.3, 0.35)
  Top 0.152: 33.53,27.51 33.53,27.81 v32.54,28.8 | 33.53,27.51 R6.1 | U$4.P3 37.19,17.07 37.19,17.74 38.26,18.81 38.26,21.43 38.1,21.59 38.1,22 38.21,22.11 38.21,30.67 U$18.P4 | v29.55,24.89 29.34,24.67 27.21,24.67 27.14,24.61 U$9.22 | v30.11,27.61 33.43,27.61 33.53,27.51
  Bottom 0.152: 32.54,29.79 35.2,29.79 37.11,31.7 U$18.P4 | 32.54,29.79 v31.47,29.79 | 32.54,29.79 v32.54,28.8 | v29.55,24.89 29.55,25.14 29.92,25.5 29.92,27.41 v30.11,27.61
SCL_SENSOR1  (via drill 0.3)
  Top 0.152: v23.77,27.43 23.77,26.36 U$9.26 | v9.05,30.54 9.04,30.52 9.04,28.16 8.23,27.36 U$21.P4 7.68,26.88 6.5,25.7 6.5,15.73 7.69,14.55 U$8.P3 10.29,14.55 R4.1
  Bottom 0.152: v23.77,27.43 19.74,31.47 9.45,31.47 9.05,31.08 v9.05,30.54
SDA  (via drill 0.3, 0.35)  (2 unrouted)
  Top 0.152: v24.77,28.42 23.09,28.42 21.41,26.75 21.41,26.36 U$9.31 | 30.71,23.01 31.39,22.33 31.39,17.98 31.93,17.45 33.07,17.45 33.68,16.84 33.68,10.71 34,10.39 v34.11,10.39 | v29.67,22.71 29.97,23.01 R10.1
  Top 0.406: R10.1 30.71,23.01
  Bottom 0.152: 24.77,29.21 24.77,30.33 22.63,32.46 22.63,34.44 21.34,35.74 21.34,36.96 | 24.77,29.21 v24.77,28.42 | 26.25,6.77 26.67,6.35 29.9,6.35 31.71,8.17 33.55,8.17 34.11,8.72 v34.11,10.39 | 24.77,29.21 28.28,29.21 28.84,28.65 28.84,25.64 28.78,25.58 28.78,24.89 29.67,24.01 v29.67,22.71
SDA_SENSOR0  (via drill 0.3)
  Top 0.152: v33.6,33.6 33.6,32.54 R5.1 | v26.36,21.34 26.89,21.86 26.89,22.71 25.51,24.08 25.07,24.08 U$9.21 | U$18.P5 37.19,34.14 37.19,33.53 38.49,32.22 38.49,21.99 v38.73,21.75
  Bottom 0.152: v33.6,33.6 36.58,33.6 37.11,34.14 U$18.P5 | v26.36,21.34 35.36,21.34 37.11,19.58 U$4.P4 37.68,19.56 38.73,20.61 v38.73,21.75
SDA_SENSOR1  (via drill 0.3)
  Top 0.152: v24.54,27.36 24.38,27.2 24.38,26.36 U$9.25 | v3.47,23.19 3.47,23.46 3.25,23.67 3.25,28.64 v4.4,29.78 | v4.11,20.74 4.11,17.46 4.09,17.45 4.09,17.05 4.29,16.85 4.29,14.83 7.08,12.05 U$8.P4 8.3,11.82 R1.1
  Bottom 0.152: v24.54,27.36 24.31,27.58 24.31,27.66 20.19,31.77 9.26,31.77 8.34,30.85 7.07,30.85 6.79,30.57 5.2,30.57 v4.41,29.78 v4.4,29.78 | v3.47,23.19 3.72,22.94 3.96,22.94 4.1,22.8 | 4.1,22.8 7.05,22.8 8.05,23.8 U$21.P5 | v4.11,20.74 4.11,22.79 4.1,22.8
SWCLK  (via drill 0.3)
  Top 0.152: 15.43,21.68 14.25,22.86 JP5.4 | 15.43,21.68 15.47,21.64 18.06,21.64 U$9.45 | v14.63,15.7 14.63,18.44 15.09,18.9 15.09,21.34 15.43,21.68 | v5.25,16.75 v5.25,19.25
  Bottom 0.127: v14.63,15.7 14.61,15.67 7.3,15.67
  Bottom 0.152: v5.25,19.25 6.25,20.25 U$5.P$3 | v5.25,16.75 5.38,16.62 6.35,16.62 7.3,15.67
SWDIO  (via drill 0.3)
  Top 0.152: v15.82,21.09 17.79,21.09 U$9.46
  Bottom 0.152: v15.82,21.09 15.65,21.27 15.65,22.68 14.25,24.08 JP5.2 13.97,24.13 12.37,25.73 6.84,25.73 6.35,25.24 U$5.P$2
USB_D_N
  Top 0.152: U$9.33 20.34,27.08 18.79,28.63 | 18.79,28.63 18.79,29.23 11.32,36.7 11.32,36.77 11.32,36.78 11.42,36.88 X1.B7 11.42,38.38 11.16,38.63 10.62,38.63 10.42,38.43 X1.A7 | 18.79,28.63
USB_D_P
  Top 0.152: 19.05,27.94 19.84,27.15 U$9.34 | 10.92,36.69 10.92,36.67 18.49,29.1 18.49,28.5 19.05,27.94 | 10.92,36.69 X1.A6 | 19.05,27.94 | X1.B6 9.92,36.79 10.02,36.69 10.92,36.69
VBUS  (via drill 0.3, 0.35)
  Top 0.254: X1.B4A9 8.5,37.9 8.5,38.36 8.94,38.8 v8.94,39.05 | C11.1 9.2,35.56 v9.1,35.46 | JP1.1 14.83,34.82 15.12,34.54 15.12,34.07 15.32,33.86 15.92,33.86 16.68,34.62 v17.06,34.62
  Top 0.305: JP1.1 14.49,35.22 14.49,35.05 13.65,35.05 13.46,35.24 13.46,35.25 13.21,35.51 v13.21,36.28 13.21,37.52 X1.A4B9
  Top 0.33: v20.89,32.73 20.65,32.49 U4.1 20.65,30.52 R15.1
  Bottom 0.254: v13.21,36.28 13.21,37.79 11.95,39.05 v8.94,39.05 9.5,38.5 9.5,35.57 9.39,35.46 v9.1,35.46
  Bottom 0.33: v17.06,34.62 19.18,34.62 20.98,32.82 v20.89,32.73
VDDANA  (via drill 0.35)
  Top 0.152: v21.26,17.37 21.34,17.45 21.34,19.36 U$9.6 | L1.2 15.52,14.73 15.75,14.5 C4.1 15.73,17.49 16.28,18.03 18.24,18.03 v18.29,17.98
  Bottom 0.152: v21.26,17.37 21.18,17.3 19.43,17.3 18.75,17.98 v18.29,17.98
VDDCORE1
  Top 0.152: U$9.43 18.06,22.63 17.49,22.63 12.4,27.72 12.4,28.8 C16.1

### Text on the board
_tsilk: Backbone | LDO: | 5V: | Service / only | RobotPatient.com | A-Sensors | B-Sensors | PWR | HB | Health | Reset | Back- / bone
_bsilk: Cortex M0 / SAMD21 | RobotPatient.com | Designed for / ManikinOS